# Altium schematic sheet 101_Connections.SchDoc: Connections
size A2; Organization: Greenfield Tech Solutions; Address1: Molendreef 33; Address2: Ossendrecht; Address3: 4641CS; Address4: The Netherlands; SheetNumber: 2; SheetTotal: 2
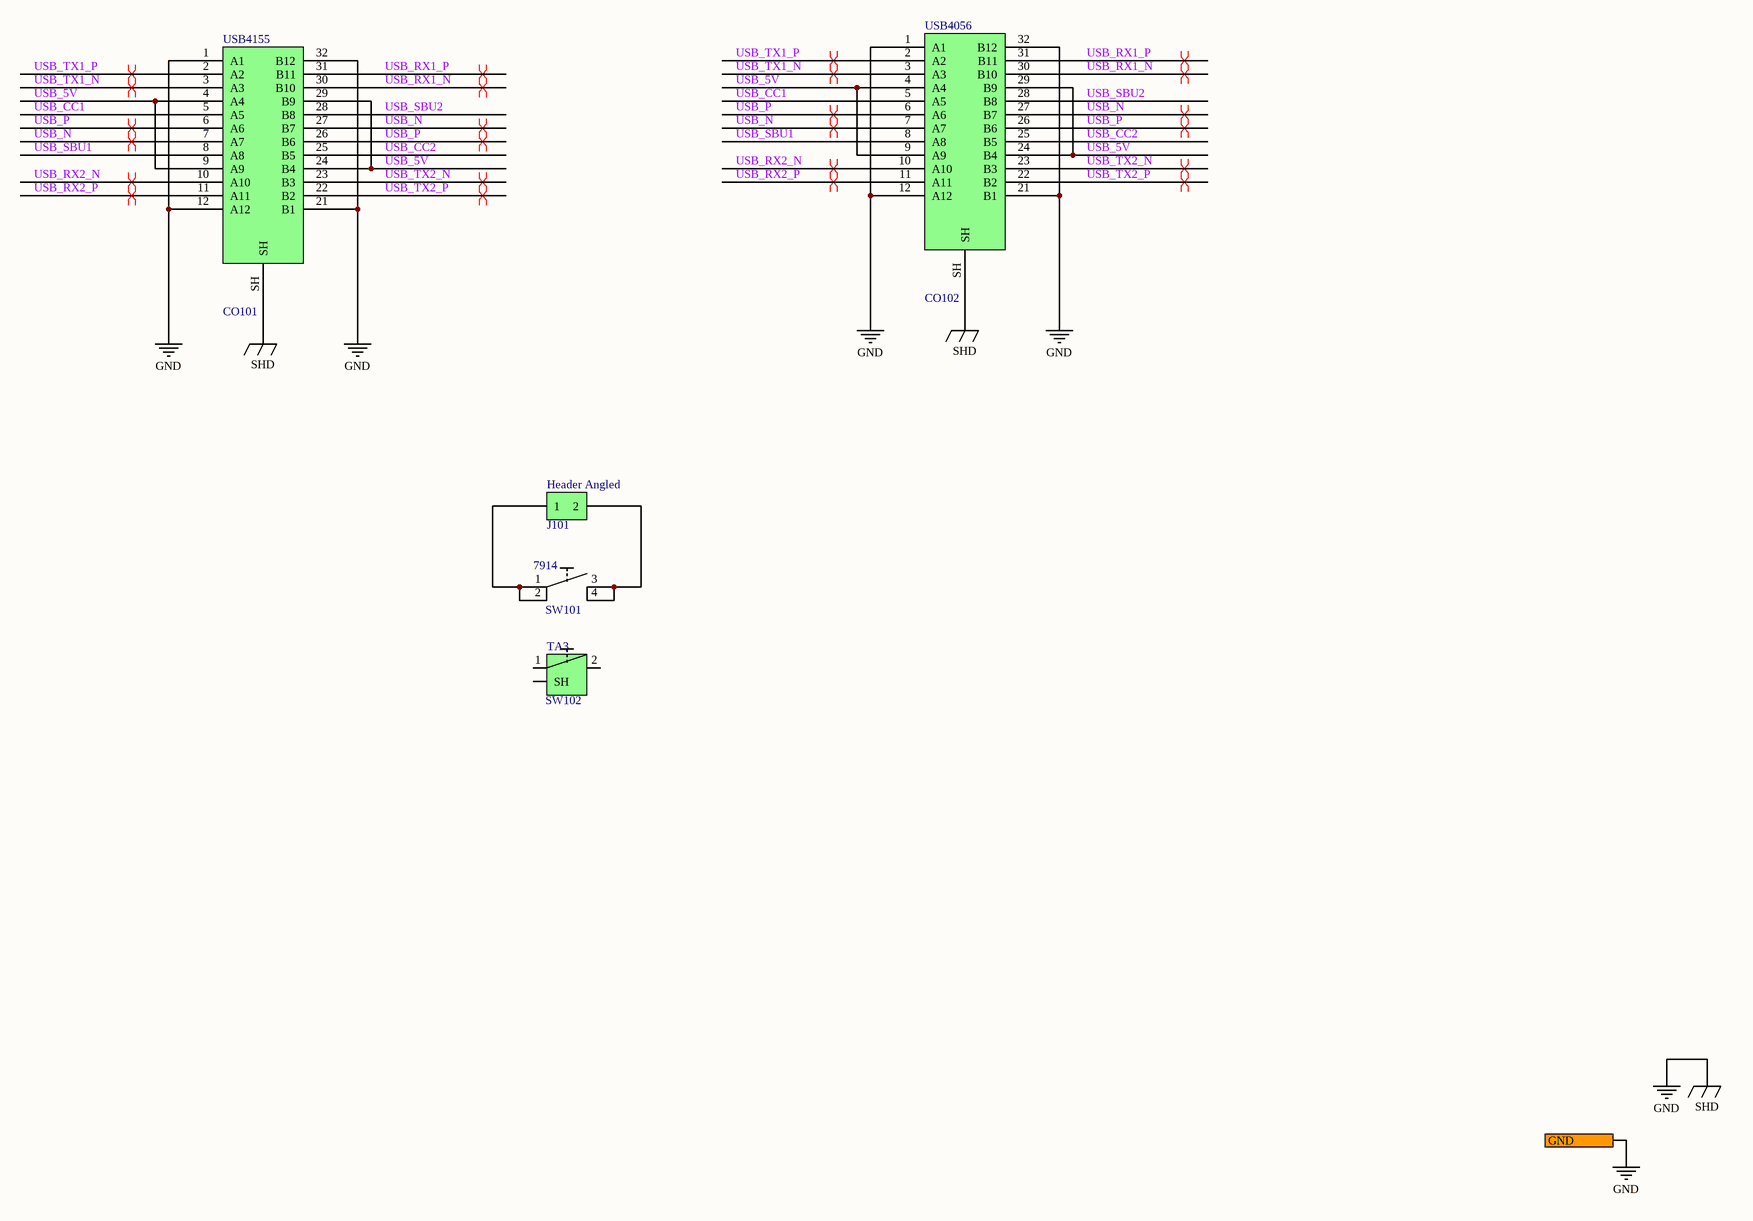
[diagram p0: 101_Connections.SchDoc]

## Parts
CO101  USB4155  [USB4155-03-C]
CO102  USB4056  [USB4056-03-A]
J101  Header Angled  [1X2P_Angled_2.54mm]
SW101  7914  [7914S]
SW102  TA3  [TA3]

## Ports
GND

## Nets
GND: CO101.1(A1) CO101.12(A12) CO101.21(B1) CO101.32(B12) CO101.SH CO102.1(A1) CO102.12(A12) CO102.21(B1) CO102.32(B12) CO102.SH ; port GND  [also labelled SHD]
USB_5V: CO101.4(A4) CO101.9(A9) CO101.24(B4) CO101.29(B9) CO102.4(A4) CO102.9(A9) CO102.24(B4) CO102.29(B9)
USB_CC1: CO101.5(A5) CO102.5(A5)
USB_CC2: CO101.25(B5) CO102.25(B5)
USB_N: CO101.7(A7) CO101.27(B7) CO102.7(A7) CO102.27(B7)
USB_P: CO101.6(A6) CO101.26(B6) CO102.6(A6) CO102.26(B6)
USB_RX1_N: CO101.30(B10) CO102.30(B10)
USB_RX1_P: CO101.31(B11) CO102.31(B11)
USB_RX2_N: CO101.10(A10) CO102.10(A10)
USB_RX2_P: CO101.11(A11) CO102.11(A11)
USB_SBU1: CO101.8(A8) CO102.8(A8)
USB_SBU2: CO101.28(B8) CO102.28(B8)
USB_TX1_N: CO101.3(A3) CO102.3(A3)
USB_TX1_P: CO101.2(A2) CO102.2(A2)
USB_TX2_N: CO101.23(B3) CO102.23(B3)
USB_TX2_P: CO101.22(B2) CO102.22(B2)
NetJ101_1: J101.1 SW101.1 SW101.2
NetJ101_2: J101.2 SW101.3 SW101.4

Not connected (* = marked no-connect by the designer): SW102 1 2 3(SH)

## Layout directives
differential pair; differential pair class USB3: USB_N, USB_P, USB_RX1_N, USB_RX1_P, USB_RX2_N, USB_RX2_P, USB_TX1_N, USB_TX1_P, USB_TX2_N, USB_TX2_P

## Notes on the sheet
- Title
- Size:
- Date:
- File:
- A2
- Number:
- Time:
- Revision:
- Sheet
- of

## Library data of the parts
CO101 = CO0031: USB C connector Plug Horizontal; Part Number: CO0031; ID: 30; RefVal: USB4155; ManfactPart: USB4155-03-C
CO102 = CO0030: USB C connector Receptacle Horizontal; Part Number: CO0030; ID: 29; RefVal: USB4056; ManfactPart: USB4056-03-A
J101 = CO0057: Header Angled 1x2P; Part Number: CO0057; ManfactPart: 10129379-902001BLF; ID: 57; RefVal: Header Angled
SW101 = SW0004: Tactile Switch Key Switch Right Angle; Part Number: SW0004; ManfactPart: 7914S-1-050E; ID: 4; RefVal: 7914
SW102 = SW0006: Tactile Switch Right Angle; Part Number: SW0006; ManfactPart: TA3-1W2-V-T/R; ID: 6; RefVal: TA3